# EasyEDA schematic SCH_BitHalo_2024-01-21.json
TITLE: Sheet_1; REV: 1.0; Date: 2023-12-23; Sheet: 1/1; Drawn By: coombed; Company: Your Company
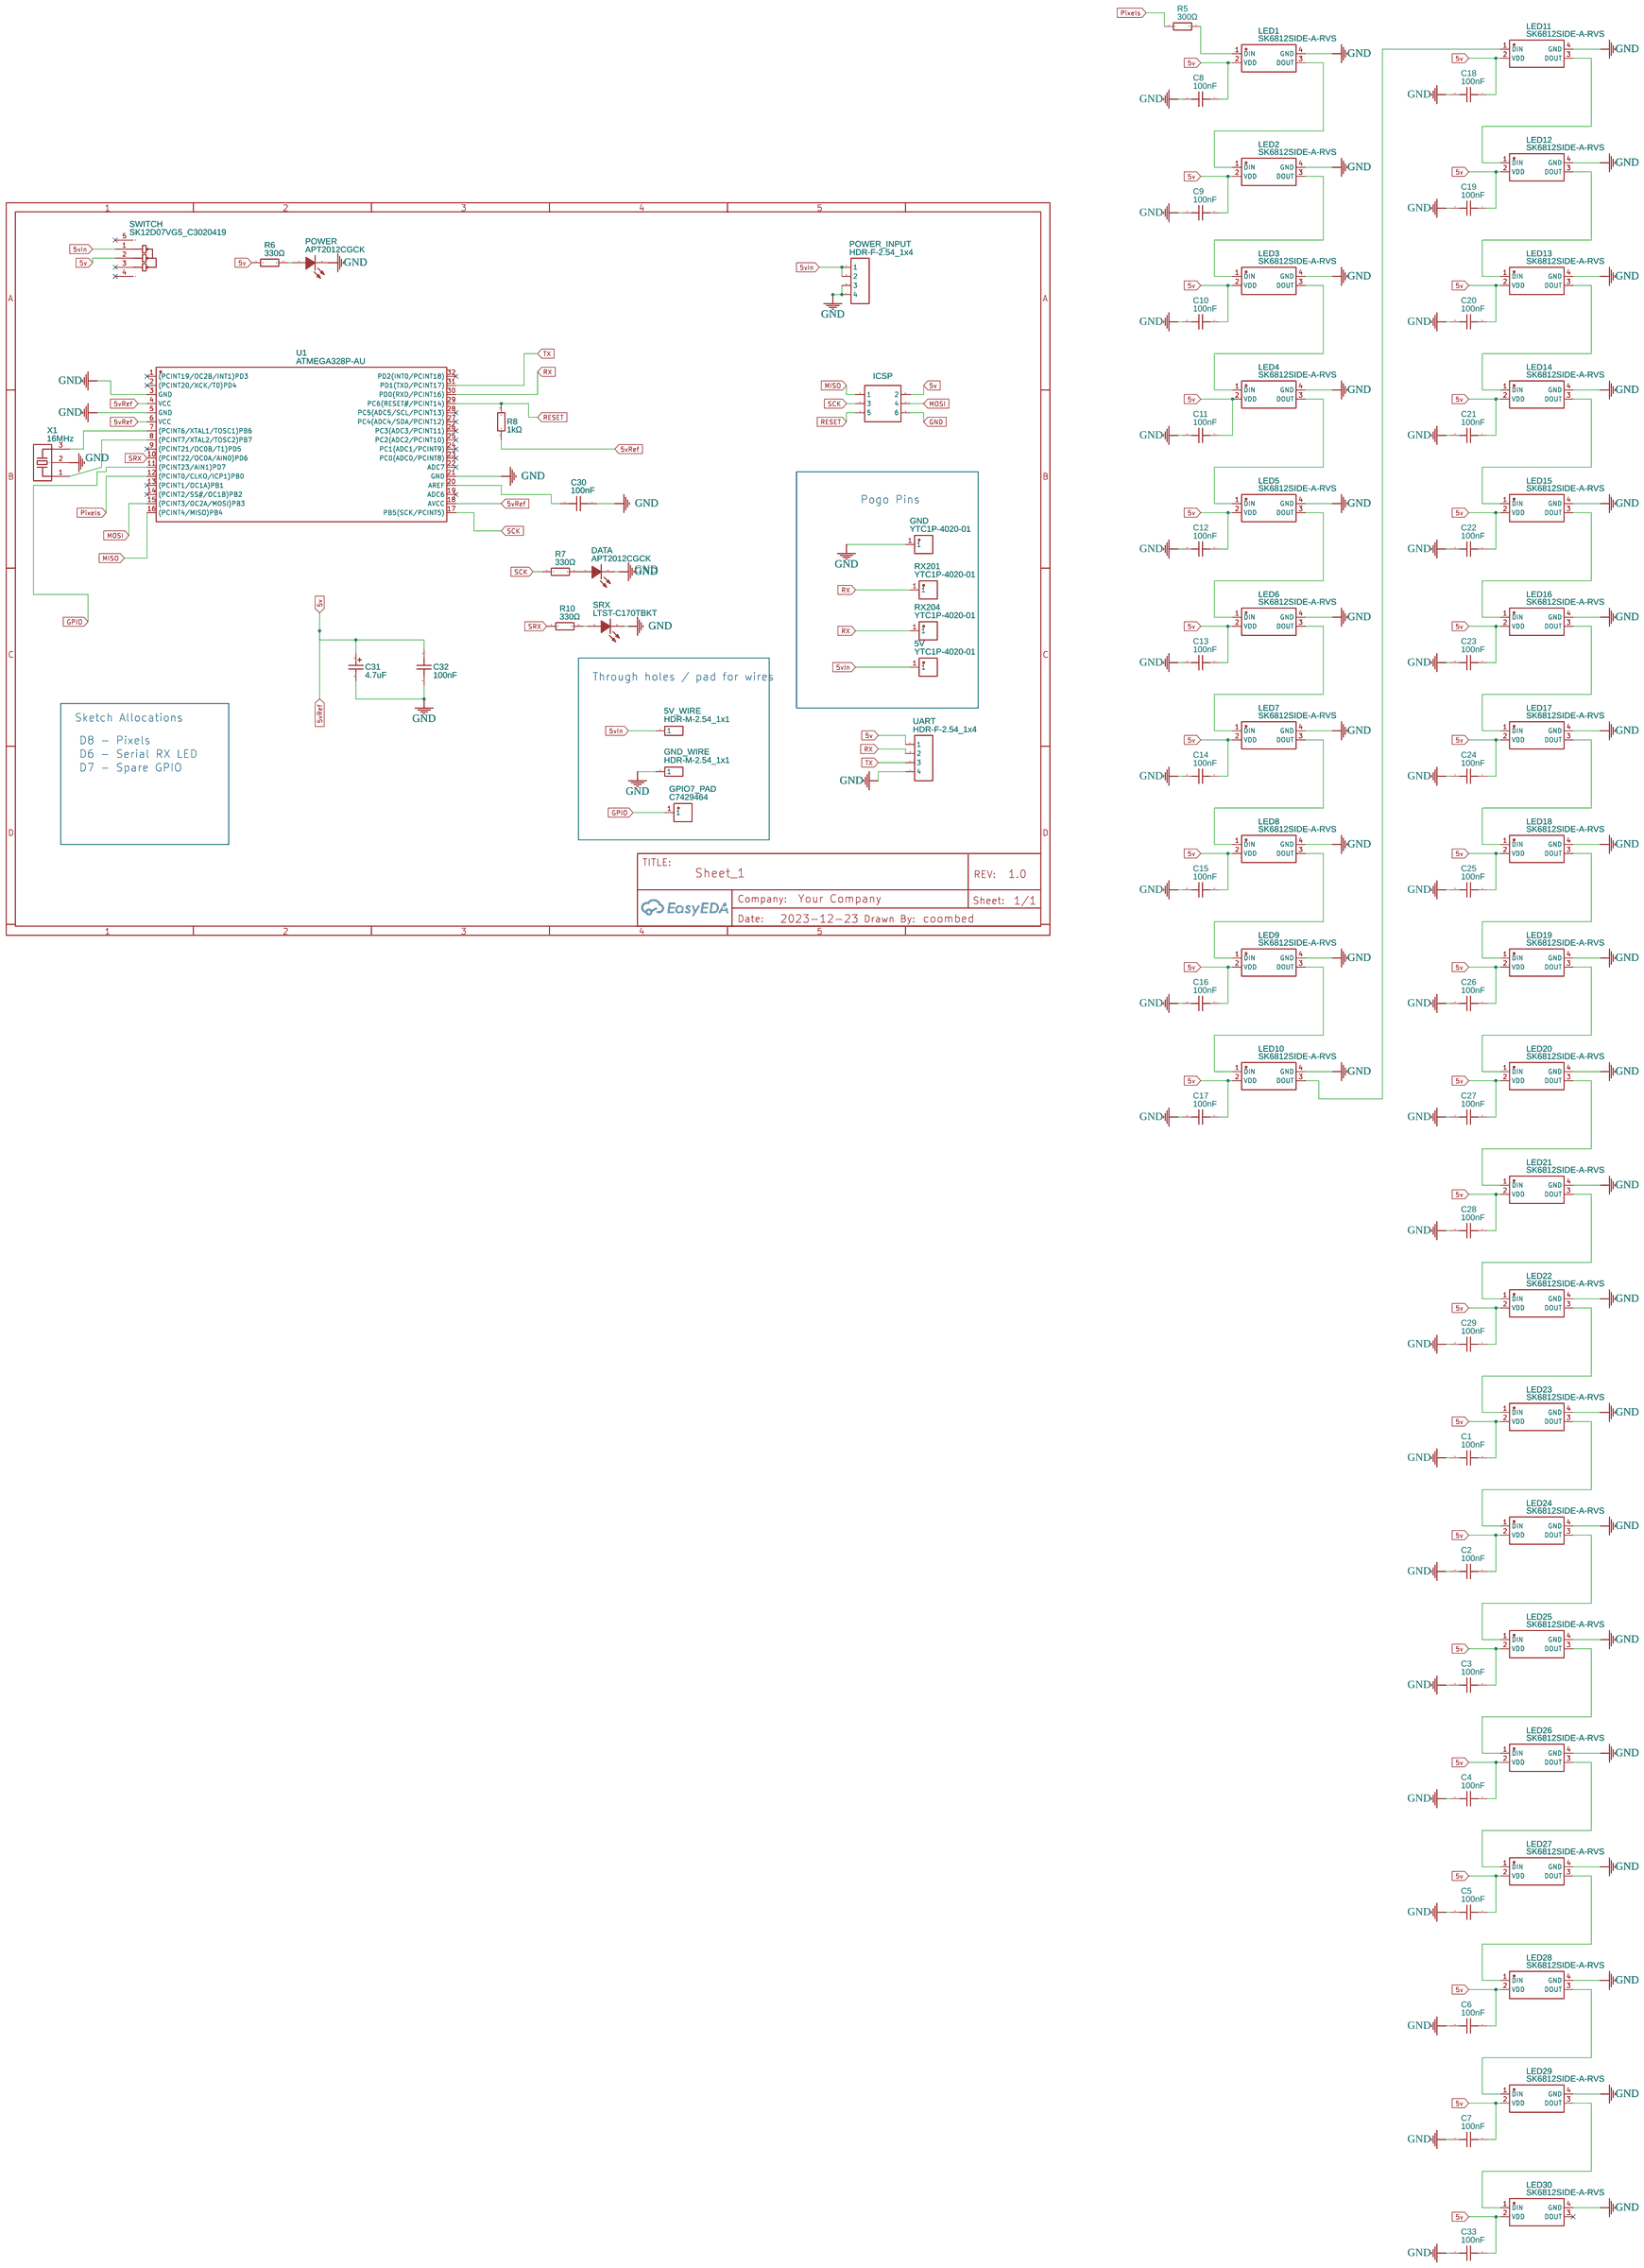
[diagram p0: schematic sheet]

## Parts
5V  YTC1P-4020-01  [TESTPOINT-SMD_BD2.0_YTC1P-4020-01]
5V_WIRE  HDR-M-2.54_1x1  [HDR-M-2.54_1X1]
C1  100nF  [C0402]
C2  100nF  [C0402]
C3  100nF  [C0402]
C4  100nF  [C0402]
C5  100nF  [C0402]
C6  100nF  [C0402]
C7  100nF  [C0402]
C8  100nF  [C0402]
C9  100nF  [C0402]
C10  100nF  [C0402]
C11  100nF  [C0402]
C12  100nF  [C0402]
C13  100nF  [C0402]
C14  100nF  [C0402]
C15  100nF  [C0402]
C16  100nF  [C0402]
C17  100nF  [C0402]
C18  100nF  [C0402]
C19  100nF  [C0402]
C20  100nF  [C0402]
C21  100nF  [C0402]
C22  100nF  [C0402]
C23  100nF  [C0402]
C24  100nF  [C0402]
C25  100nF  [C0402]
C26  100nF  [C0402]
C27  100nF  [C0402]
C28  100nF  [C0402]
C29  100nF  [C0402]
C30  100nF  [C0805]
C31  4.7uF  [CASE-A_3216]
C32  100nF  [C0805]
C33  100nF  [C0402]
DATA  APT2012CGCK  [LED-SMD_L2.0-W1.3-R-RD]
GND  YTC1P-4020-01  [TESTPOINT-SMD_BD2.0_YTC1P-4020-01]
GND_WIRE  HDR-M-2.54_1x1  [HDR-M-2.54_1X1]
GPIO7_PAD  C7429464  [SMD-1_BD2.0-H10.0]
ICSP  Header-Male-2.54_2x3  [HDR-TH_6P-P2.54-V-M-R2-C3-S2.54-1]
LED1  SK6812SIDE-A-RVS  [LED-SMD_4P-L4.0-W1.6-L]
LED2  SK6812SIDE-A-RVS  [LED-SMD_4P-L4.0-W1.6-L]
LED3  SK6812SIDE-A-RVS  [LED-SMD_4P-L4.0-W1.6-L]
LED4  SK6812SIDE-A-RVS  [LED-SMD_4P-L4.0-W1.6-L]
LED5  SK6812SIDE-A-RVS  [LED-SMD_4P-L4.0-W1.6-L]
LED6  SK6812SIDE-A-RVS  [LED-SMD_4P-L4.0-W1.6-L]
LED7  SK6812SIDE-A-RVS  [LED-SMD_4P-L4.0-W1.6-L]
LED8  SK6812SIDE-A-RVS  [LED-SMD_4P-L4.0-W1.6-L]
LED9  SK6812SIDE-A-RVS  [LED-SMD_4P-L4.0-W1.6-L]
LED10  SK6812SIDE-A-RVS  [LED-SMD_4P-L4.0-W1.6-L]
LED11  SK6812SIDE-A-RVS  [LED-SMD_4P-L4.0-W1.6-L]
LED12  SK6812SIDE-A-RVS  [LED-SMD_4P-L4.0-W1.6-L]
LED13  SK6812SIDE-A-RVS  [LED-SMD_4P-L4.0-W1.6-L]
LED14  SK6812SIDE-A-RVS  [LED-SMD_4P-L4.0-W1.6-L]
LED15  SK6812SIDE-A-RVS  [LED-SMD_4P-L4.0-W1.6-L]
LED16  SK6812SIDE-A-RVS  [LED-SMD_4P-L4.0-W1.6-L]
LED17  SK6812SIDE-A-RVS  [LED-SMD_4P-L4.0-W1.6-L]
LED18  SK6812SIDE-A-RVS  [LED-SMD_4P-L4.0-W1.6-L]
LED19  SK6812SIDE-A-RVS  [LED-SMD_4P-L4.0-W1.6-L]
LED20  SK6812SIDE-A-RVS  [LED-SMD_4P-L4.0-W1.6-L]
LED21  SK6812SIDE-A-RVS  [LED-SMD_4P-L4.0-W1.6-L]
LED22  SK6812SIDE-A-RVS  [LED-SMD_4P-L4.0-W1.6-L]
LED23  SK6812SIDE-A-RVS  [LED-SMD_4P-L4.0-W1.6-L]
LED24  SK6812SIDE-A-RVS  [LED-SMD_4P-L4.0-W1.6-L]
LED25  SK6812SIDE-A-RVS  [LED-SMD_4P-L4.0-W1.6-L]
LED26  SK6812SIDE-A-RVS  [LED-SMD_4P-L4.0-W1.6-L]
LED27  SK6812SIDE-A-RVS  [LED-SMD_4P-L4.0-W1.6-L]
LED28  SK6812SIDE-A-RVS  [LED-SMD_4P-L4.0-W1.6-L]
LED29  SK6812SIDE-A-RVS  [LED-SMD_4P-L4.0-W1.6-L]
LED30  SK6812SIDE-A-RVS  [LED-SMD_4P-L4.0-W1.6-L]
POWER  APT2012CGCK  [LED-SMD_L2.0-W1.3-R-RD]
POWER_INPUT  HDR-F-2.54_1x4  [HDR-F-2.54_1X4]
R5  300Ω  [R0603]
R6  330Ω  [R0402]
R7  330Ω  [R0402]
R8  1kΩ  [R0402]
R10  330Ω  [R0402]
RX201  YTC1P-4020-01  [TESTPOINT-SMD_BD2.0_YTC1P-4020-01]
RX204  YTC1P-4020-01  [TESTPOINT-SMD_BD2.0_YTC1P-4020-01]
SRX  LTST-C170TBKT  [LED0805-RD_BLUE]
SWITCH  SK12D07VG5_C3020419  [SW-TH_SHOU_SK12D07VG5]
U1  ATMEGA328P-AU  [TQFP-32_L7.0-W7.0-P0.80-LS9.0-BL]
UART  HDR-F-2.54_1x4  [HDR-F-2.54_1X4]
X1  16MHz  [OSC-SMD_3P-L3.2-W1.3-P0.95-L]

## Library data of the parts
5V GND RX201 RX204 = YTC1P-4020-01: Supplier: LCSC; Supplier Part: C5221284; Manufacturer: YIYUAN(怡远); JLCPCB Part Class: Extended Part; Contributor: lcsc
5V_WIRE GND_WIRE = HDR-M-2.54_1x1: Supplier Part: C81276; Supplier: LCSC; Contributor: LCEDA_Lib
C1-C29 C33 = CT41G-0402-2X1-16V-0.1μF-K(N): Contributor: LCSC; Supplier: LCSC; Supplier Part: C141382; Manufacturer: TORCH(火炬); JLCPCB Part Class: Extended Part
C30 C32 = C0805C104K5RACTU_C3018562: Contributor: lcsc; Supplier: LCSC; Supplier Part: C3018562; Manufacturer: KEMET(基美); Manufacturer Part: C0805C104K5RACTU; JLCPCB Part Class: Extended Part
C31 = CA45-A016K475T: Supplier: LCSC; Manufacturer: 湘怡中元/湘江; Supplier Part: C123256; JLCPCB Part Class: Extended Part
DATA POWER = APT2012CGCK: Contributor: lcsc; Supplier: LCSC; Supplier Part: C5875740; Manufacturer: Kingbright
GPIO7_PAD = YTC1P-2510-01: Supplier: LCSC; Manufacturer: YIYUAN(怡远); JLCPCB Part Class: Extended Part; Contributor: lcsc; Package Display: No
ICSP = Header-Male-2.54_2x3: Supplier: LCSC; Manufacturer: BOOMELE(博穆精密); Manufacturer Part: 2.54-2*3P针; Supplier Part: C65114; JLCPCB Part Class: Extended Part
LED1-LED30 = SK6812SIDE-A-RVS: Contributor: LCSC; Supplier: LCSC; Supplier Part: C2890037; Manufacturer: 欧思科光电; JLCPCB Part Class: Extended Part
POWER_INPUT UART = HDR-F-2.54_1x4: Supplier Part: C225501; Supplier: LCSC; Contributor: LCEDA_Lib
R5 = 0603WAF3000T5E: Supplier: LCSC; Manufacturer: UNI-ROYAL(厚声); Supplier Part: C23025; JLCPCB Part Class: Basic Part
R6 R7 R10 = 0402WGF6800TCE: Supplier: LCSC; Manufacturer: UNI-ROYAL(厚声); Supplier Part: C364993; JLCPCB Part Class: Basic Part
R8 = RC0402FR-071KL: Supplier: LCSC; Manufacturer: YAGEO(国巨); Supplier Part: C106235; JLCPCB Part Class: Extended Part
SRX = LTST-C170TBKT: Contributor: LCSC; Supplier: LCSC; Manufacturer: LITEON(光宝); Supplier Part: C98222; JLCPCB Part Class: Extended Part
SWITCH = SK12D07VG5_C3020419: Contributor: lcsc; Supplier: LCSC; Supplier Part: C3020419; Manufacturer: SHOU HAN(首韩); Manufacturer Part: SK12D07VG5; JLCPCB Part Class: Extended Part
U1 = ATMEGA328P-AU: Supplier: LCSC; Manufacturer: MICROCHIP(美国微芯); Supplier Part: C14877; JLCPCB Part Class: Basic Part
X1 = CSTCE16M0V53-R0: Supplier: LCSC; Manufacturer: muRata(村田); Supplier Part: C32180; JLCPCB Part Class: Extended Part

## Nets
5v: C1.1 C2.1 C3.1 C4.1 C5.1 C6.1 C7.1 C8.1 C9.1 C10.1 C11.1 C12.1 C13.1 C14.1 C15.1 C16.1 C17.1 C18.1 C19.1 C20.1 C21.1 C22.1 C23.1 C24.1 C25.1 C26.1 C27.1 C28.1 C29.1 C31.1 C32.1 C33.1 ICSP.2 LED1.2(VDD) LED2.2(VDD) LED3.2(VDD) LED4.2(VDD) LED5.2(VDD) LED6.2(VDD) LED7.2(VDD) LED8.2(VDD) LED9.2(VDD) LED10.2(VDD) LED11.2(VDD) LED12.2(VDD) LED13.2(VDD) LED14.2(VDD) LED15.2(VDD) LED16.2(VDD) LED17.2(VDD) LED18.2(VDD) LED19.2(VDD) LED20.2(VDD) LED21.2(VDD) LED22.2(VDD) LED23.2(VDD) LED24.2(VDD) LED25.2(VDD) LED26.2(VDD) LED27.2(VDD) LED28.2(VDD) LED29.2(VDD) LED30.2(VDD) R6.1 R8.1 SWITCH.2 U1.4(VCC) U1.6(VCC) U1.18(AVCC) UART.1
5vIn: 5V.1 5V_WIRE.1 POWER_INPUT.1 POWER_INPUT.2 SWITCH.1
GND: C1.2 C2.2 C3.2 C4.2 C5.2 C6.2 C7.2 C8.2 C9.2 C10.2 C11.2 C12.2 C13.2 C14.2 C15.2 C16.2 C17.2 C18.2 C19.2 C20.2 C21.2 C22.2 C23.2 C24.2 C25.2 C26.2 C27.2 C28.2 C29.2 C30.2 C31.2 C32.2 C33.2 DATA.2(K) GND.1 GND_WIRE.1 ICSP.6 LED1.4(GND) LED2.4(GND) LED3.4(GND) LED4.4(GND) LED5.4(GND) LED6.4(GND) LED7.4(GND) LED8.4(GND) LED9.4(GND) LED10.4(GND) LED11.4(GND) LED12.4(GND) LED13.4(GND) LED14.4(GND) LED15.4(GND) LED16.4(GND) LED17.4(GND) LED18.4(GND) LED19.4(GND) LED20.4(GND) LED21.4(GND) LED22.4(GND) LED23.4(GND) LED24.4(GND) LED25.4(GND) LED26.4(GND) LED27.4(GND) LED28.4(GND) LED29.4(GND) LED30.4(GND) POWER.2(K) POWER_INPUT.3 POWER_INPUT.4 SRX.1(K) U1.3(GND) U1.5(GND) U1.21(GND) UART.4 X1.2
GPIO: GPIO7_PAD.1 U1.11((PCINT23/AIN1)PD7)
MISO: ICSP.1 U1.16((PCINT4/MISO)PB4)
MOSI: ICSP.4 U1.15((PCINT3/OC2A/MOSI)PB3)
Pixels: R5.1 U1.12((PCINT0/CLKO/ICP1)PB0)
RESET: ICSP.5 R8.2 U1.29(PC6(RESET#/PCINT14))
RX: RX201.1 RX204.1 U1.30(PD0(RXD/PCINT16)) UART.2
SCK: ICSP.3 R7.1 U1.17(PB5(SCK/PCINT5))
SRX: R10.1 U1.10((PCINT22/OC0A/AIN0)PD6)
TX: U1.31(PD1(TXD/PCINT17)) UART.3
Net-(C30-1): C30.1 U1.20(AREF)
Net-(DATA-1): DATA.1(A) R7.2
Net-(LED1-1): LED1.1(DIN) R5.2
Net-(LED1-3): LED1.3(DOUT) LED2.1(DIN)
Net-(LED2-3): LED2.3(DOUT) LED3.1(DIN)
Net-(LED3-3): LED3.3(DOUT) LED4.1(DIN)
Net-(LED4-3): LED4.3(DOUT) LED5.1(DIN)
Net-(LED5-3): LED5.3(DOUT) LED6.1(DIN)
Net-(LED6-3): LED6.3(DOUT) LED7.1(DIN)
Net-(LED7-3): LED7.3(DOUT) LED8.1(DIN)
Net-(LED8-3): LED8.3(DOUT) LED9.1(DIN)
Net-(LED9-3): LED9.3(DOUT) LED10.1(DIN)
Net-(LED10-3): LED10.3(DOUT) LED11.1(DIN)
Net-(LED11-3): LED11.3(DOUT) LED12.1(DIN)
Net-(LED12-3): LED12.3(DOUT) LED13.1(DIN)
Net-(LED13-3): LED13.3(DOUT) LED14.1(DIN)
Net-(LED14-3): LED14.3(DOUT) LED15.1(DIN)
Net-(LED15-3): LED15.3(DOUT) LED16.1(DIN)
Net-(LED16-3): LED16.3(DOUT) LED17.1(DIN)
Net-(LED17-3): LED17.3(DOUT) LED18.1(DIN)
Net-(LED18-3): LED18.3(DOUT) LED19.1(DIN)
Net-(LED19-3): LED19.3(DOUT) LED20.1(DIN)
Net-(LED20-3): LED20.3(DOUT) LED21.1(DIN)
Net-(LED21-3): LED21.3(DOUT) LED22.1(DIN)
Net-(LED22-3): LED22.3(DOUT) LED23.1(DIN)
Net-(LED23-3): LED23.3(DOUT) LED24.1(DIN)
Net-(LED24-3): LED24.3(DOUT) LED25.1(DIN)
Net-(LED25-3): LED25.3(DOUT) LED26.1(DIN)
Net-(LED26-3): LED26.3(DOUT) LED27.1(DIN)
Net-(LED27-3): LED27.3(DOUT) LED28.1(DIN)
Net-(LED28-3): LED28.3(DOUT) LED29.1(DIN)
Net-(LED29-3): LED29.3(DOUT) LED30.1(DIN)
Net-(POWER-1): POWER.1(A) R6.2
Net-(R10-2): R10.2 SRX.2(A)
Net-(U1-7): U1.7((PCINT6/XTAL1/TOSC1)PB6) X1.3
Net-(U1-8): U1.8((PCINT7/XTAL2/TOSC2)PB7) X1.1

Not connected (* = marked no-connect by the designer): LED30 3(DOUT)*; SWITCH 3* 4* 5*; U1 1((PCINT19/OC2B/INT1)PD3)* 2((PCINT20/XCK/T0)PD4)* 9((PCINT21/OC0B/T1)PD5)* 13((PCINT1/OC1A)PB1)* 14((PCINT2/SS#/OC1B)PB2)* 19(ADC6)* 22(ADC7)* 23(PC0(ADC0/PCINT8))* 24(PC1(ADC1/PCINT9))* 25(PC2(ADC2/PCINT10))* 26(PC3(ADC3/PCINT11))* 27(PC4(ADC4/SDA/PCINT12))* 28(PC5(ADC5/SCL/PCINT13))* 32(PD2(INT0/PCINT18))*

## Notes on the sheet
- Pogo Pins
- GND
- Through holes / pad for wires
- Sketch Allocations
- D8 - Pixels
- D6 - Serial RX LED
- D7 - Spare GPIO
